# Altium schematic sheet Mezzanine.SCHDOC: FPGA Rack
size 420 x 297 mm; DrawnBy: zas; Revision: V1.0; SheetNumber: 9; SheetTotal: 25; DocumentName: Mezzanine.SCHDOC
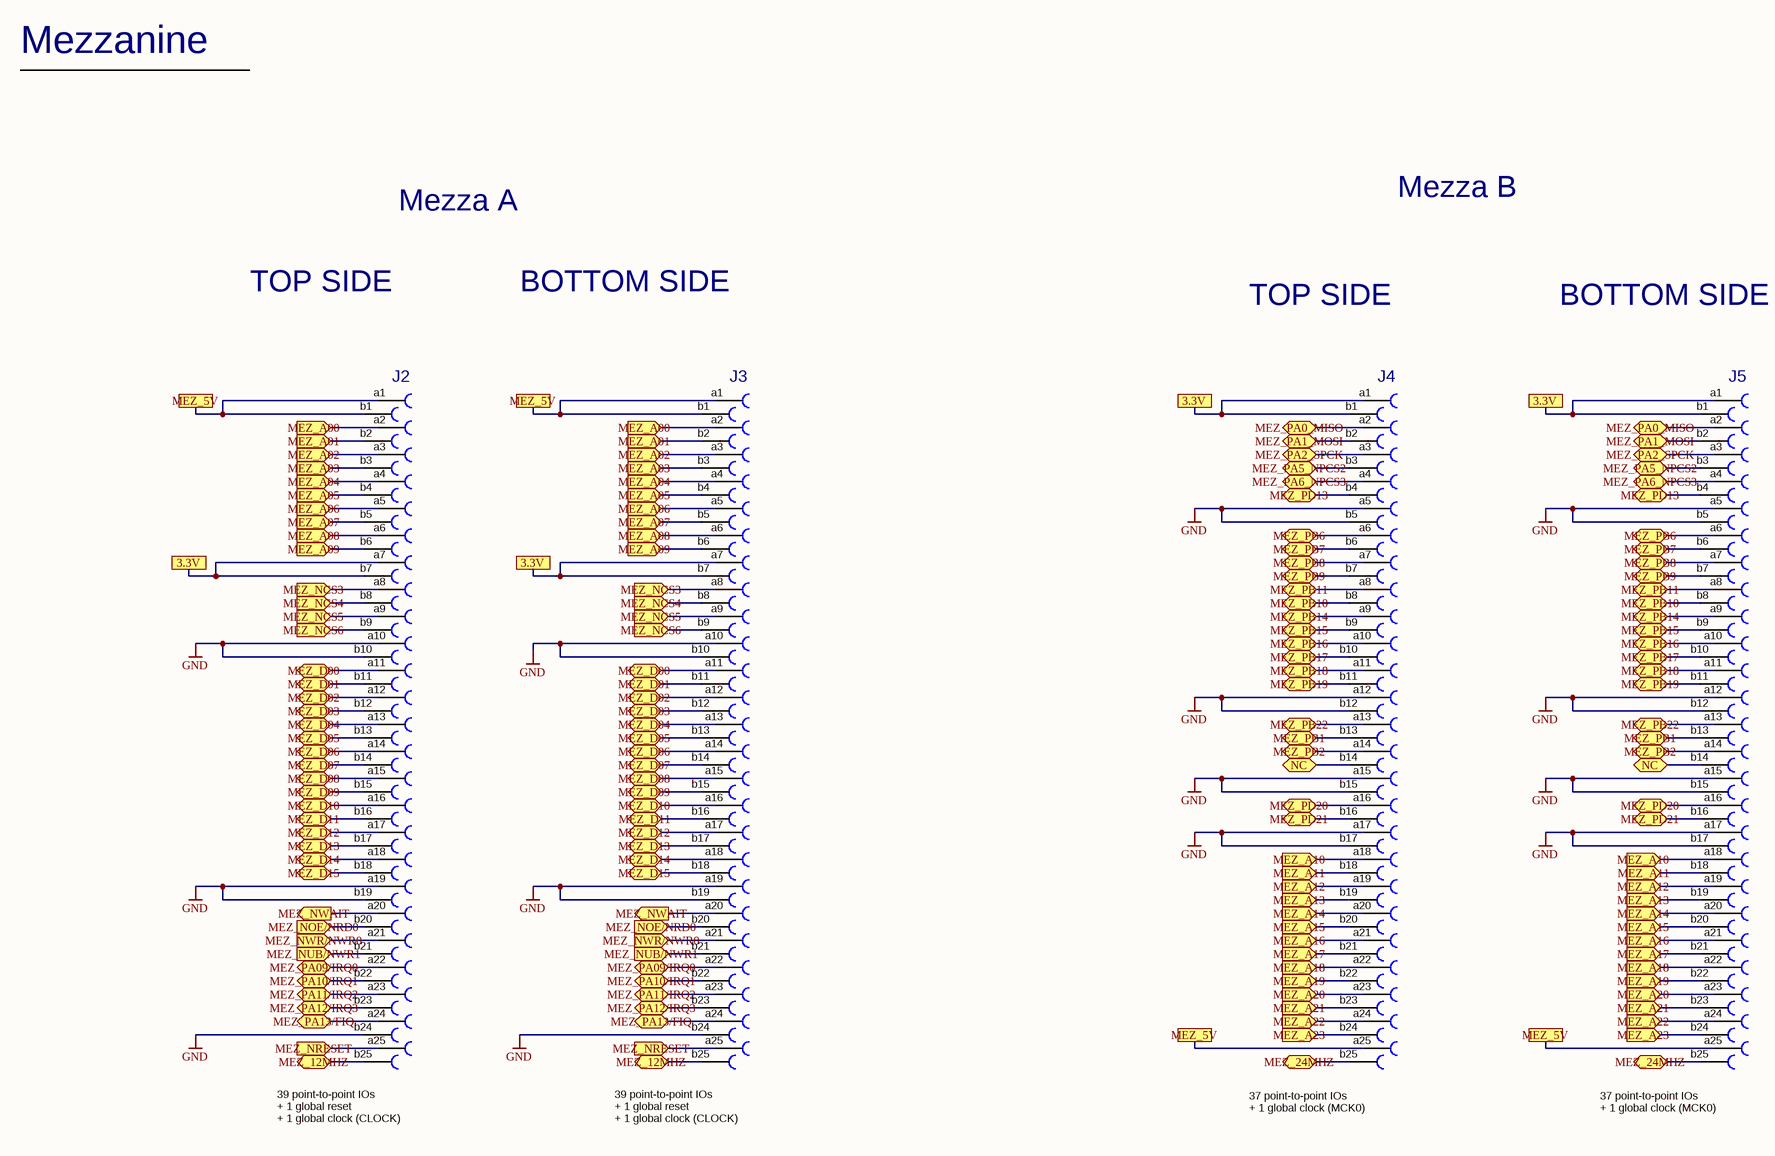
[diagram p0: Mezzanine.SCHDOC]

## Parts
J2  ERNI-SMC-50P-FD  [ERNI-SMC-50P-FD]  (value not drawn)
J3  ERNI-SMC-50P-MD  [ERNI-SMC-50P-MD]  (value not drawn)
J4  ERNI-SMC-50P-FD  [ERNI-SMC-50P-FD]  (value not drawn)
J5  ERNI-SMC-50P-MD  [ERNI-SMC-50P-MD]  (value not drawn)

## Ports
3.3V, MEZ_5V, MEZ_12MHZ (bidir), MEZ_24MHZ (bidir), MEZ_A00 (in), MEZ_A01 (in), MEZ_A02 (in), MEZ_A03 (in), MEZ_A04 (in), MEZ_A05 (in), MEZ_A06 (in), MEZ_A07 (in), MEZ_A08 (in), MEZ_A09 (in), MEZ_A10 (in), MEZ_A11 (in), MEZ_A12 (in), MEZ_A13 (in), MEZ_A14 (in), MEZ_A15 (in), MEZ_A16 (in), MEZ_A17 (in), MEZ_A18 (in), MEZ_A19 (in), MEZ_A20 (in), MEZ_A21 (in), MEZ_A22 (in), MEZ_A23 (in), MEZ_D00 (bidir), MEZ_D01 (bidir), MEZ_D02 (bidir), MEZ_D03 (bidir), MEZ_D04 (bidir), MEZ_D05 (bidir), MEZ_D06 (bidir), MEZ_D07 (bidir), MEZ_D08 (bidir), MEZ_D09 (bidir), MEZ_D10 (bidir), MEZ_D11 (bidir), MEZ_D12 (bidir), MEZ_D13 (bidir), MEZ_D14 (bidir), MEZ_D15 (bidir), MEZ_NCS3 (in), MEZ_NCS4 (in), MEZ_NCS5 (in), MEZ_NCS6 (in), MEZ_NOE/NRD0 (in), MEZ_NRESET (in), MEZ_NUB/NWR1 (in), MEZ_NWAIT (out), MEZ_NWR/NWR0 (in), MEZ_PA0_MISO (bidir), MEZ_PA1_MOSI (bidir), MEZ_PA2_SPCK (bidir), MEZ_PA5_NPCS2 (bidir), MEZ_PA6_NPCS3 (bidir), MEZ_PA09/IRQ0 (bidir), MEZ_PA10/IRQ1 (bidir), MEZ_PA11/IRQ2 (bidir), MEZ_PA12/IRQ3 (bidir), MEZ_PA13/FIQ (bidir), MEZ_PB1 (bidir), MEZ_PB2 (bidir), MEZ_PB6 (bidir), MEZ_PB7 (bidir), MEZ_PB8 (bidir), MEZ_PB9 (bidir), MEZ_PB10 (bidir), MEZ_PB11 (bidir), MEZ_PB14 (bidir), MEZ_PB15 (bidir), MEZ_PB16 (bidir), MEZ_PB17 (bidir), MEZ_PB18 (bidir), MEZ_PB19 (bidir), MEZ_PB22 (bidir), MEZ_PD13 (bidir), MEZ_PD20 (bidir), MEZ_PD21 (bidir), NC (bidir)

## Nets
GND: J2.a10 J2.a19 J2.b10 J2.b19 J2.b24 J3.a10 J3.a19 J3.b10 J3.b19 J3.b24 J4.a5 J4.a12 J4.a15 J4.a17 J4.b5 J4.b12 J4.b15 J4.b17 J5.a5 J5.a12 J5.a15 J5.a17 J5.b5 J5.b12 J5.b15 J5.b17
MEZ_12MHZ: J2.b25 J3.b25 ; port MEZ_12MHZ
MEZ_24MHZ: J4.b25 J5.b25 ; port MEZ_24MHZ
MEZ_A00: J2.a2 J3.a2 ; port MEZ_A00
MEZ_A01: J2.b2 J3.b2 ; port MEZ_A01
MEZ_A02: J2.a3 J3.a3 ; port MEZ_A02
MEZ_A03: J2.b3 J3.b3 ; port MEZ_A03
MEZ_A04: J2.a4 J3.a4 ; port MEZ_A04
MEZ_A05: J2.b4 J3.b4 ; port MEZ_A05
MEZ_A06: J2.a5 J3.a5 ; port MEZ_A06
MEZ_A07: J2.b5 J3.b5 ; port MEZ_A07
MEZ_A08: J2.a6 J3.a6 ; port MEZ_A08
MEZ_A09: J2.b6 J3.b6 ; port MEZ_A09
MEZ_A10: J4.a18 J5.a18 ; port MEZ_A10
MEZ_A11: J4.b18 J5.b18 ; port MEZ_A11
MEZ_A12: J4.a19 J5.a19 ; port MEZ_A12
MEZ_A13: J4.b19 J5.b19 ; port MEZ_A13
MEZ_A14: J4.a20 J5.a20 ; port MEZ_A14
MEZ_A15: J4.b20 J5.b20 ; port MEZ_A15
MEZ_A16: J4.a21 J5.a21 ; port MEZ_A16
MEZ_A17: J4.b21 J5.b21 ; port MEZ_A17
MEZ_A18: J4.a22 J5.a22 ; port MEZ_A18
MEZ_A19: J4.b22 J5.b22 ; port MEZ_A19
MEZ_A20: J4.a23 J5.a23 ; port MEZ_A20
MEZ_A21: J4.b23 J5.b23 ; port MEZ_A21
MEZ_A22: J4.a24 J5.a24 ; port MEZ_A22
MEZ_A23: J4.b24 J5.b24 ; port MEZ_A23
MEZ_D00: J2.a11 J3.a11 ; port MEZ_D00
MEZ_D01: J2.b11 J3.b11 ; port MEZ_D01
MEZ_D02: J2.a12 J3.a12 ; port MEZ_D02
MEZ_D03: J2.b12 J3.b12 ; port MEZ_D03
MEZ_D04: J2.a13 J3.a13 ; port MEZ_D04
MEZ_D05: J2.b13 J3.b13 ; port MEZ_D05
MEZ_D06: J2.a14 J3.a14 ; port MEZ_D06
MEZ_D07: J2.b14 J3.b14 ; port MEZ_D07
MEZ_D08: J2.a15 J3.a15 ; port MEZ_D08
MEZ_D09: J2.b15 J3.b15 ; port MEZ_D09
MEZ_D10: J2.a16 J3.a16 ; port MEZ_D10
MEZ_D11: J2.b16 J3.b16 ; port MEZ_D11
MEZ_D12: J2.a17 J3.a17 ; port MEZ_D12
MEZ_D13: J2.b17 J3.b17 ; port MEZ_D13
MEZ_D14: J2.a18 J3.a18 ; port MEZ_D14
MEZ_D15: J2.b18 J3.b18 ; port MEZ_D15
MEZ_NCS3: J2.a8 J3.a8 ; port MEZ_NCS3
MEZ_NCS4: J2.b8 J3.b8 ; port MEZ_NCS4
MEZ_NCS5: J2.a9 J3.a9 ; port MEZ_NCS5
MEZ_NCS6: J2.b9 J3.b9 ; port MEZ_NCS6
MEZ_NOE/NRD0: J2.b20 J3.b20 ; port MEZ_NOE/NRD0
MEZ_NRESET: J2.a25 J3.a25 ; port MEZ_NRESET
MEZ_NUB/NWR1: J2.b21 J3.b21 ; port MEZ_NUB/NWR1
MEZ_NWAIT: J2.a20 J3.a20 ; port MEZ_NWAIT
MEZ_NWR/NWR0: J2.a21 J3.a21 ; port MEZ_NWR/NWR0
MEZ_PA0_MISO: J4.a2 J5.a2 ; port MEZ_PA0_MISO
MEZ_PA1_MOSI: J4.b2 J5.b2 ; port MEZ_PA1_MOSI
MEZ_PA2_SPCK: J4.a3 J5.a3 ; port MEZ_PA2_SPCK
MEZ_PA5_NPCS2: J4.b3 J5.b3 ; port MEZ_PA5_NPCS2
MEZ_PA6_NPCS3: J4.a4 J5.a4 ; port MEZ_PA6_NPCS3
MEZ_PA09/IRQ0: J2.a22 J3.a22 ; port MEZ_PA09/IRQ0
MEZ_PA10/IRQ1: J2.b22 J3.b22 ; port MEZ_PA10/IRQ1
MEZ_PA11/IRQ2: J2.a23 J3.a23 ; port MEZ_PA11/IRQ2
MEZ_PA12/IRQ3: J2.b23 J3.b23 ; port MEZ_PA12/IRQ3
MEZ_PA13/FIQ: J2.a24 J3.a24 ; port MEZ_PA13/FIQ
MEZ_PB1: J4.b13 J5.b13 ; port MEZ_PB1
MEZ_PB2: J4.a14 J5.a14 ; port MEZ_PB2
MEZ_PB6: J4.a6 J5.a6 ; port MEZ_PB6
MEZ_PB7: J4.b6 J5.b6 ; port MEZ_PB7
MEZ_PB8: J4.a7 J5.a7 ; port MEZ_PB8
MEZ_PB9: J4.b7 J5.b7 ; port MEZ_PB9
MEZ_PB10: J4.b8 J5.b8 ; port MEZ_PB10
MEZ_PB11: J4.a8 J5.a8 ; port MEZ_PB11
MEZ_PB14: J4.a9 J5.a9 ; port MEZ_PB14
MEZ_PB15: J4.b9 J5.b9 ; port MEZ_PB15
MEZ_PB16: J4.a10 J5.a10 ; port MEZ_PB16
MEZ_PB17: J4.b10 J5.b10 ; port MEZ_PB17
MEZ_PB18: J4.a11 J5.a11 ; port MEZ_PB18
MEZ_PB19: J4.b11 J5.b11 ; port MEZ_PB19
MEZ_PB22: J4.a13 J5.a13 ; port MEZ_PB22
MEZ_PD13: J4.b4 J5.b4 ; port MEZ_PD13
MEZ_PD20: J4.a16 J5.a16 ; port MEZ_PD20
MEZ_PD21: J4.b16 J5.b16 ; port MEZ_PD21
NC: J4.b14 J5.b14 ; port NC
NetJ2_a1: J2.a1 J2.b1
NetJ2_a7: J2.a7 J2.b7
NetJ3_a1: J3.a1 J3.b1
NetJ3_a7: J3.a7 J3.b7
NetJ4_a1: J4.a1 J4.b1
NetJ5_a1: J5.a1 J5.b1

Not connected (* = marked no-connect by the designer): J2 NC1 NC2 NC3 NC4 NC5 NC6; J4 a25(49) NC1 NC2 NC3 NC4 NC5 NC6; J5 a25(49)

## Notes on the sheet
- Mezzanine
- Mezza A
- Mezza B
- TOP SIDE
- BOTTOM SIDE
- (near J2) 39 point-to-point IOs
  + 1 global reset
  + 1 global clock (CLOCK)
- (near J3) 39 point-to-point IOs
  + 1 global reset
  + 1 global clock (CLOCK)
- (near J4) 37 point-to-point IOs
  + 1 global clock (MCK0)
- (near J5) 37 point-to-point IOs
  + 1 global clock (MCK0)
- DES
- HES-SO // Valais Wallis
- HAUTE ECOLE VALAISANNE
- /
- REV
- {Path}

## Library data of the parts
J2 J4 = ERNI-SMC-50P-FD: Connecteur Smd serie SMC pas 1.27 ERNI - Distrelec 12 06 39; partition: Mezzanine; RefDes2: {RefDes2}; MEZZAONLY: YES; Value: *
J3 J5 = ERNI-SMC-50P-MD: Connecteur Smd serie SMC pas 1.27 ERNI - Distrelec 12 06 42; partition: Mezzanine; RefDes2: {RefDes2}; MEZZAONLY: YES; Value: *